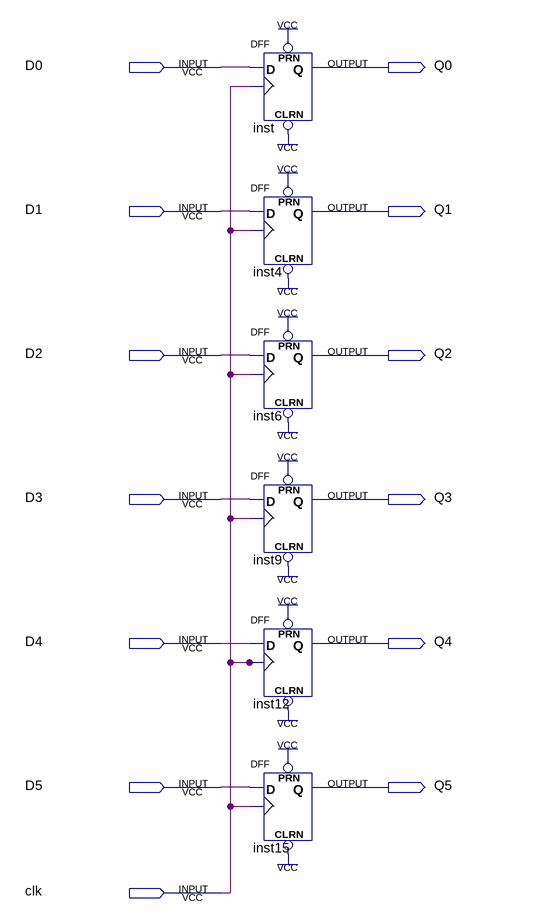
[diagram p0: schematic sheet]
// Quartus schematic Block1.bdf as structural Verilog: 6 symbols, 13 pins
module Block1 (
  input  D0,
  input  D1,
  input  D2,
  input  D3,
  input  D4,
  input  D5,
  input  clk,
  output Q0,
  output Q1,
  output Q2,
  output Q3,
  output Q4,
  output Q5
);

  DFF inst (.CLRN(1'b1), .CLK(clk), .D(D0), .PRN(1'b1), .Q(Q0));
  DFF inst4 (.CLRN(1'b1), .CLK(clk), .D(D1), .PRN(1'b1), .Q(Q1));
  DFF inst6 (.CLRN(1'b1), .CLK(clk), .D(D2), .PRN(1'b1), .Q(Q2));
  DFF inst9 (.CLRN(1'b1), .CLK(clk), .D(D3), .PRN(1'b1), .Q(Q3));
  DFF inst12 (.CLRN(1'b1), .CLK(clk), .D(D4), .PRN(1'b1), .Q(Q4));
  DFF inst15 (.CLRN(1'b1), .CLK(clk), .D(D5), .PRN(1'b1), .Q(Q5));
endmodule
